# EAGLE design button_pad_6x10_v19 (EAGLE 6.4)
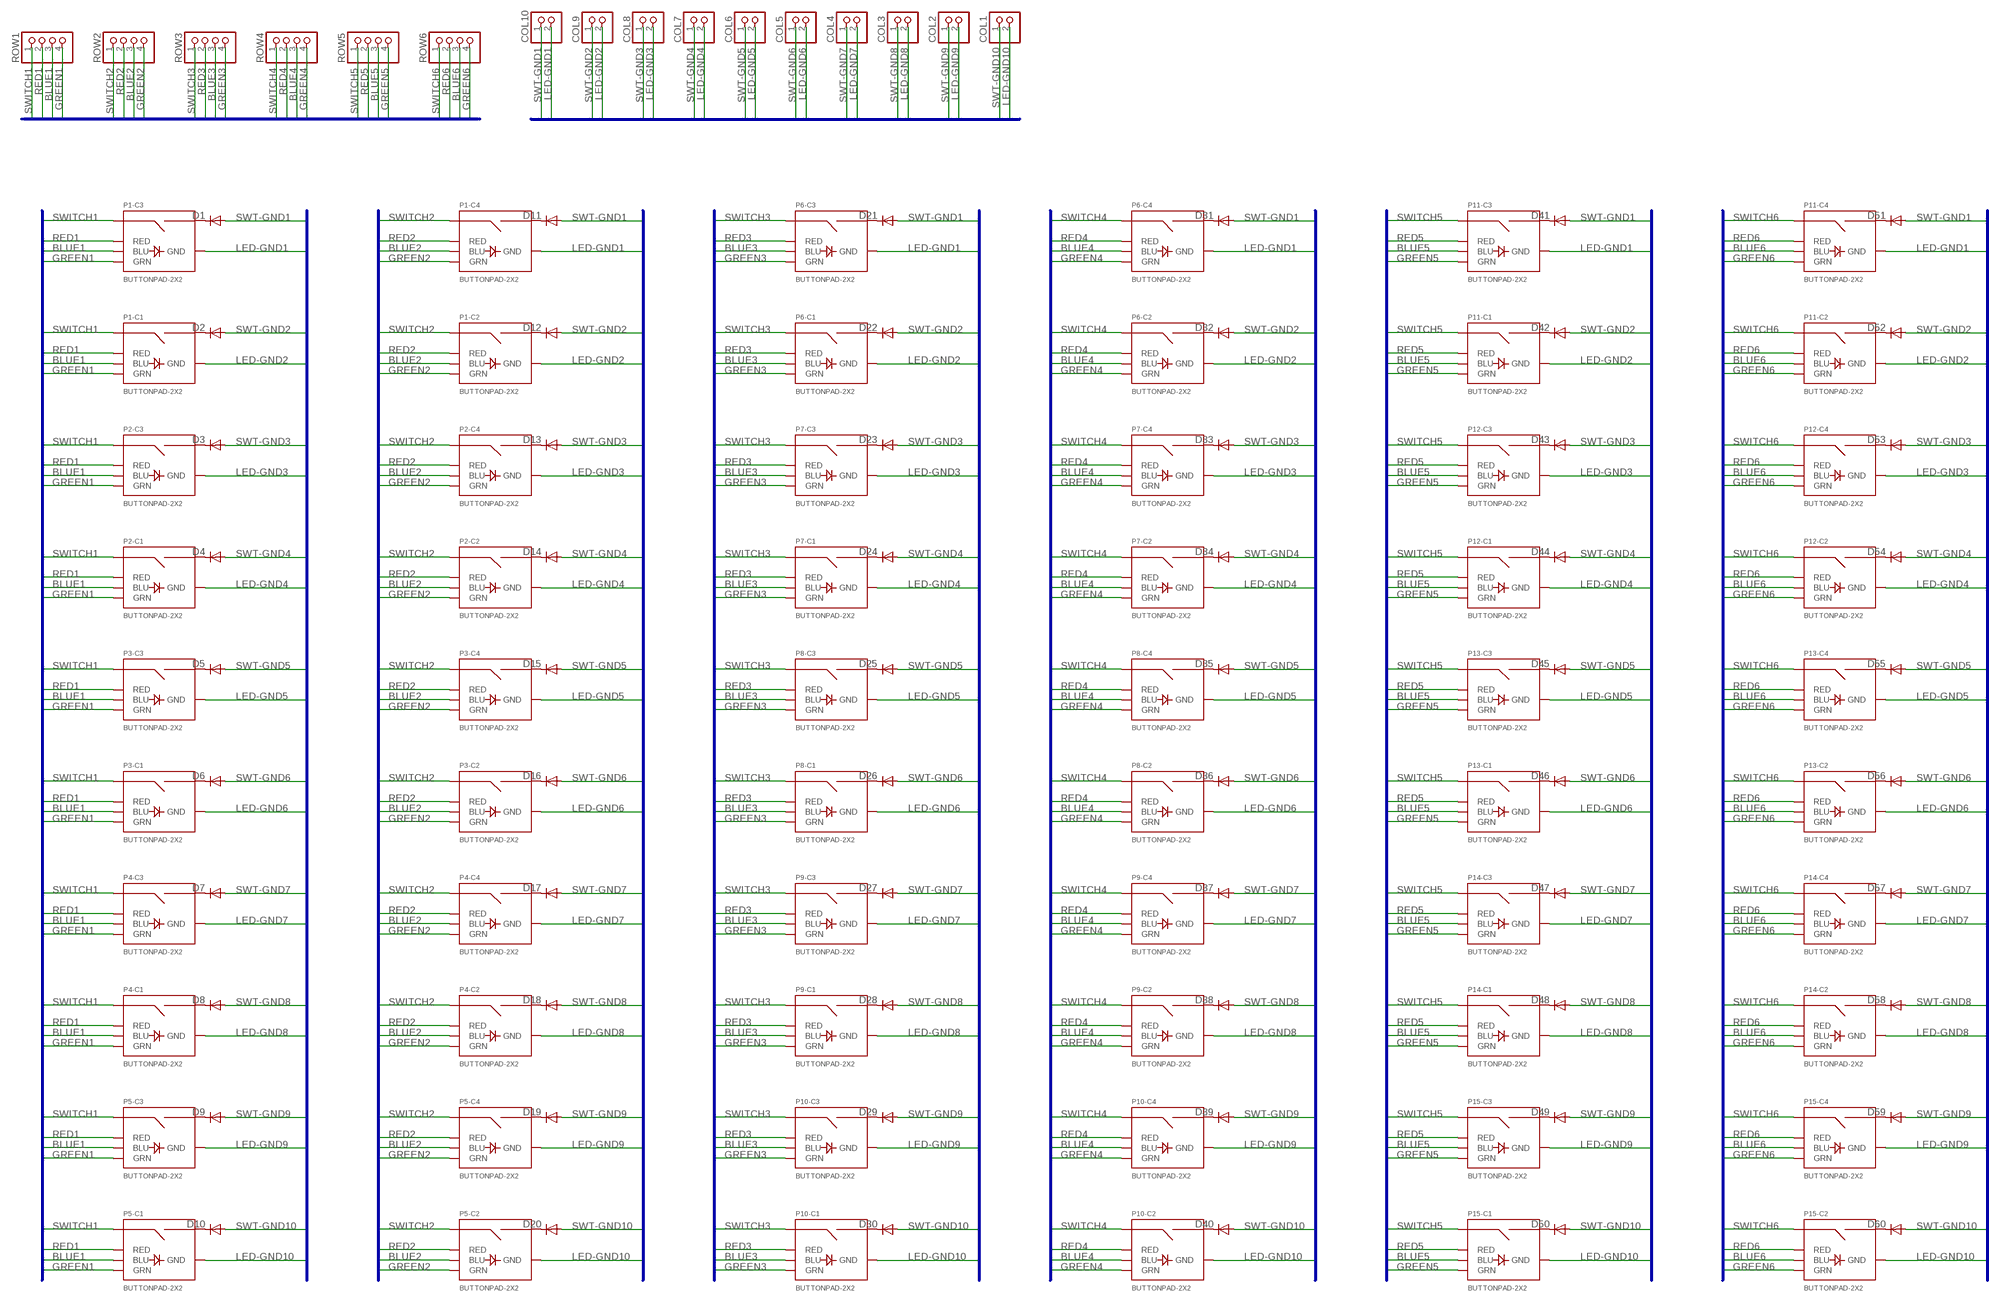
[diagram p0: schematic, sheet 1]

## Parts
COL1  PINHD-1X2  [1X02]
COL2  PINHD-1X2  [1X02]
COL3  PINHD-1X2  [1X02]
COL4  PINHD-1X2  [1X02]
COL5  PINHD-1X2  [1X02]
COL6  PINHD-1X2  [1X02]
COL7  PINHD-1X2  [1X02]
COL8  PINHD-1X2  [1X02]
COL9  PINHD-1X2  [1X02]
COL10  PINHD-1X2  [1X02]
D1  DIODE-1N4148  [DOIDE-1N4148]
D2  DIODE-1N4148  [DOIDE-1N4148]
D3  DIODE-1N4148  [DOIDE-1N4148]
D4  DIODE-1N4148  [DOIDE-1N4148]
D5  DIODE-1N4148  [DOIDE-1N4148]
D6  DIODE-1N4148  [DOIDE-1N4148]
D7  DIODE-1N4148  [DOIDE-1N4148]
D8  DIODE-1N4148  [DOIDE-1N4148]
D9  DIODE-1N4148  [DOIDE-1N4148]
D10  DIODE-1N4148  [DOIDE-1N4148]
D11  DIODE-1N4148  [DOIDE-1N4148]
D12  DIODE-1N4148  [DOIDE-1N4148]
D13  DIODE-1N4148  [DOIDE-1N4148]
D14  DIODE-1N4148  [DOIDE-1N4148]
D15  DIODE-1N4148  [DOIDE-1N4148]
D16  DIODE-1N4148  [DOIDE-1N4148]
D17  DIODE-1N4148  [DOIDE-1N4148]
D18  DIODE-1N4148  [DOIDE-1N4148]
D19  DIODE-1N4148  [DOIDE-1N4148]
D20  DIODE-1N4148  [DOIDE-1N4148]
D21  DIODE-1N4148  [DOIDE-1N4148]
D22  DIODE-1N4148  [DOIDE-1N4148]
D23  DIODE-1N4148  [DOIDE-1N4148]
D24  DIODE-1N4148  [DOIDE-1N4148]
D25  DIODE-1N4148  [DOIDE-1N4148]
D26  DIODE-1N4148  [DOIDE-1N4148]
D27  DIODE-1N4148  [DOIDE-1N4148]
D28  DIODE-1N4148  [DOIDE-1N4148]
D29  DIODE-1N4148  [DOIDE-1N4148]
D30  DIODE-1N4148  [DOIDE-1N4148]
D31  DIODE-1N4148  [DOIDE-1N4148]
D32  DIODE-1N4148  [DOIDE-1N4148]
D33  DIODE-1N4148  [DOIDE-1N4148]
D34  DIODE-1N4148  [DOIDE-1N4148]
D35  DIODE-1N4148  [DOIDE-1N4148]
D36  DIODE-1N4148  [DOIDE-1N4148]
D37  DIODE-1N4148  [DOIDE-1N4148]
D38  DIODE-1N4148  [DOIDE-1N4148]
D39  DIODE-1N4148  [DOIDE-1N4148]
D40  DIODE-1N4148  [DOIDE-1N4148]
D41  DIODE-1N4148  [DOIDE-1N4148]
D42  DIODE-1N4148  [DOIDE-1N4148]
D43  DIODE-1N4148  [DOIDE-1N4148]
D44  DIODE-1N4148  [DOIDE-1N4148]
D45  DIODE-1N4148  [DOIDE-1N4148]
D46  DIODE-1N4148  [DOIDE-1N4148]
D47  DIODE-1N4148  [DOIDE-1N4148]
D48  DIODE-1N4148  [DOIDE-1N4148]
D49  DIODE-1N4148  [DOIDE-1N4148]
D50  DIODE-1N4148  [DOIDE-1N4148]
D51  DIODE-1N4148  [DOIDE-1N4148]
D52  DIODE-1N4148  [DOIDE-1N4148]
D53  DIODE-1N4148  [DOIDE-1N4148]
D54  DIODE-1N4148  [DOIDE-1N4148]
D55  DIODE-1N4148  [DOIDE-1N4148]
D56  DIODE-1N4148  [DOIDE-1N4148]
D57  DIODE-1N4148  [DOIDE-1N4148]
D58  DIODE-1N4148  [DOIDE-1N4148]
D59  DIODE-1N4148  [DOIDE-1N4148]
D60  DIODE-1N4148  [DOIDE-1N4148]
P1  BUTTONPAD-2X2  [BUTTONPAD-2X2]
P2  BUTTONPAD-2X2  [BUTTONPAD-2X2]
P3  BUTTONPAD-2X2  [BUTTONPAD-2X2]
P4  BUTTONPAD-2X2  [BUTTONPAD-2X2]
P5  BUTTONPAD-2X2  [BUTTONPAD-2X2]
P6  BUTTONPAD-2X2  [BUTTONPAD-2X2]
P7  BUTTONPAD-2X2  [BUTTONPAD-2X2]
P8  BUTTONPAD-2X2  [BUTTONPAD-2X2]
P9  BUTTONPAD-2X2  [BUTTONPAD-2X2]
P10  BUTTONPAD-2X2  [BUTTONPAD-2X2]
P11  BUTTONPAD-2X2  [BUTTONPAD-2X2]
P12  BUTTONPAD-2X2  [BUTTONPAD-2X2]
P13  BUTTONPAD-2X2  [BUTTONPAD-2X2]
P14  BUTTONPAD-2X2  [BUTTONPAD-2X2]
P15  BUTTONPAD-2X2  [BUTTONPAD-2X2]
ROW1  PINHD-1X4  [1X04]
ROW2  PINHD-1X4  [1X04]
ROW3  PINHD-1X4  [1X04]
ROW4  PINHD-1X4  [1X04]
ROW5  PINHD-1X4  [1X04]
ROW6  PINHD-1X4  [1X04]

## Nets
BLUE1 [LEDPower]: P1.BLU1(-C1:BLU) P1.BLU3(-C3:BLU) P2.BLU1(-C1:BLU) P2.BLU3(-C3:BLU) P3.BLU1(-C1:BLU) P3.BLU3(-C3:BLU) P4.BLU1(-C1:BLU) P4.BLU3(-C3:BLU) P5.BLU1(-C1:BLU) P5.BLU3(-C3:BLU) ROW1.3
BLUE2 [LEDPower]: P1.BLU2(-C2:BLU) P1.BLU4(-C4:BLU) P2.BLU2(-C2:BLU) P2.BLU4(-C4:BLU) P3.BLU2(-C2:BLU) P3.BLU4(-C4:BLU) P4.BLU2(-C2:BLU) P4.BLU4(-C4:BLU) P5.BLU2(-C2:BLU) P5.BLU4(-C4:BLU) ROW2.3
BLUE3 [LEDPower]: P6.BLU1(-C1:BLU) P6.BLU3(-C3:BLU) P7.BLU1(-C1:BLU) P7.BLU3(-C3:BLU) P8.BLU1(-C1:BLU) P8.BLU3(-C3:BLU) P9.BLU1(-C1:BLU) P9.BLU3(-C3:BLU) P10.BLU1(-C1:BLU) P10.BLU3(-C3:BLU) ROW3.3
BLUE4 [LEDPower]: P6.BLU2(-C2:BLU) P6.BLU4(-C4:BLU) P7.BLU2(-C2:BLU) P7.BLU4(-C4:BLU) P8.BLU2(-C2:BLU) P8.BLU4(-C4:BLU) P9.BLU2(-C2:BLU) P9.BLU4(-C4:BLU) P10.BLU2(-C2:BLU) P10.BLU4(-C4:BLU) ROW4.3
BLUE5 [LEDPower]: P11.BLU1(-C1:BLU) P11.BLU3(-C3:BLU) P12.BLU1(-C1:BLU) P12.BLU3(-C3:BLU) P13.BLU1(-C1:BLU) P13.BLU3(-C3:BLU) P14.BLU1(-C1:BLU) P14.BLU3(-C3:BLU) P15.BLU1(-C1:BLU) P15.BLU3(-C3:BLU) ROW5.3
BLUE6 [LEDPower]: P11.BLU2(-C2:BLU) P11.BLU4(-C4:BLU) P12.BLU2(-C2:BLU) P12.BLU4(-C4:BLU) P13.BLU2(-C2:BLU) P13.BLU4(-C4:BLU) P14.BLU2(-C2:BLU) P14.BLU4(-C4:BLU) P15.BLU2(-C2:BLU) P15.BLU4(-C4:BLU) ROW6.3
GREEN1 [LEDPower]: P1.GRN1(-C1:GRN) P1.GRN3(-C3:GRN) P2.GRN1(-C1:GRN) P2.GRN3(-C3:GRN) P3.GRN1(-C1:GRN) P3.GRN3(-C3:GRN) P4.GRN1(-C1:GRN) P4.GRN3(-C3:GRN) P5.GRN1(-C1:GRN) P5.GRN3(-C3:GRN) ROW1.4
GREEN2 [LEDPower]: P1.GRN2(-C2:GRN) P1.GRN4(-C4:GRN) P2.GRN2(-C2:GRN) P2.GRN4(-C4:GRN) P3.GRN2(-C2:GRN) P3.GRN4(-C4:GRN) P4.GRN2(-C2:GRN) P4.GRN4(-C4:GRN) P5.GRN2(-C2:GRN) P5.GRN4(-C4:GRN) ROW2.4
GREEN3 [LEDPower]: P6.GRN1(-C1:GRN) P6.GRN3(-C3:GRN) P7.GRN1(-C1:GRN) P7.GRN3(-C3:GRN) P8.GRN1(-C1:GRN) P8.GRN3(-C3:GRN) P9.GRN1(-C1:GRN) P9.GRN3(-C3:GRN) P10.GRN1(-C1:GRN) P10.GRN3(-C3:GRN) ROW3.4
GREEN4 [LEDPower]: P6.GRN2(-C2:GRN) P6.GRN4(-C4:GRN) P7.GRN2(-C2:GRN) P7.GRN4(-C4:GRN) P8.GRN2(-C2:GRN) P8.GRN4(-C4:GRN) P9.GRN2(-C2:GRN) P9.GRN4(-C4:GRN) P10.GRN2(-C2:GRN) P10.GRN4(-C4:GRN) ROW4.4
GREEN5 [LEDPower]: P11.GRN1(-C1:GRN) P11.GRN3(-C3:GRN) P12.GRN1(-C1:GRN) P12.GRN3(-C3:GRN) P13.GRN1(-C1:GRN) P13.GRN3(-C3:GRN) P14.GRN1(-C1:GRN) P14.GRN3(-C3:GRN) P15.GRN1(-C1:GRN) P15.GRN3(-C3:GRN) ROW5.4
GREEN6 [LEDPower]: P11.GRN2(-C2:GRN) P11.GRN4(-C4:GRN) P12.GRN2(-C2:GRN) P12.GRN4(-C4:GRN) P13.GRN2(-C2:GRN) P13.GRN4(-C4:GRN) P14.GRN2(-C2:GRN) P14.GRN4(-C4:GRN) P15.GRN2(-C2:GRN) P15.GRN4(-C4:GRN) ROW6.4
LED-GND1 [LEDPower]: COL10.2 P1.GND3(-C3:GND) P1.GND4(-C4:GND) P6.GND3(-C3:GND) P6.GND4(-C4:GND) P11.GND3(-C3:GND) P11.GND4(-C4:GND)
LED-GND2 [LEDPower]: COL9.2 P1.GND1(-C1:GND) P1.GND2(-C2:GND) P6.GND1(-C1:GND) P6.GND2(-C2:GND) P11.GND1(-C1:GND) P11.GND2(-C2:GND)
LED-GND3 [LEDPower]: COL8.2 P2.GND3(-C3:GND) P2.GND4(-C4:GND) P7.GND3(-C3:GND) P7.GND4(-C4:GND) P12.GND3(-C3:GND) P12.GND4(-C4:GND)
LED-GND4 [LEDPower]: COL7.2 P2.GND1(-C1:GND) P2.GND2(-C2:GND) P7.GND1(-C1:GND) P7.GND2(-C2:GND) P12.GND1(-C1:GND) P12.GND2(-C2:GND)
LED-GND5 [LEDPower]: COL6.2 P3.GND3(-C3:GND) P3.GND4(-C4:GND) P8.GND3(-C3:GND) P8.GND4(-C4:GND) P13.GND3(-C3:GND) P13.GND4(-C4:GND)
LED-GND6 [LEDPower]: COL5.2 P3.GND1(-C1:GND) P3.GND2(-C2:GND) P8.GND1(-C1:GND) P8.GND2(-C2:GND) P13.GND1(-C1:GND) P13.GND2(-C2:GND)
LED-GND7 [LEDPower]: COL4.2 P4.GND3(-C3:GND) P4.GND4(-C4:GND) P9.GND3(-C3:GND) P9.GND4(-C4:GND) P14.GND3(-C3:GND) P14.GND4(-C4:GND)
LED-GND8 [LEDPower]: COL3.2 P4.GND1(-C1:GND) P4.GND2(-C2:GND) P9.GND1(-C1:GND) P9.GND2(-C2:GND) P14.GND1(-C1:GND) P14.GND2(-C2:GND)
LED-GND9 [LEDPower]: COL2.2 P5.GND3(-C3:GND) P5.GND4(-C4:GND) P10.GND3(-C3:GND) P10.GND4(-C4:GND) P15.GND3(-C3:GND) P15.GND4(-C4:GND)
LED-GND10 [LEDPower]: COL1.2 P5.GND1(-C1:GND) P5.GND2(-C2:GND) P10.GND1(-C1:GND) P10.GND2(-C2:GND) P15.GND1(-C1:GND) P15.GND2(-C2:GND)
N$1: D1.P$2(C) P1.SIG6(-C3:SIG2)
N$2: D2.P$2(C) P1.SIG2(-C1:SIG2)
N$3: D3.P$2(C) P2.SIG6(-C3:SIG2)
N$4: D4.P$2(C) P2.SIG2(-C1:SIG2)
N$5: D5.P$2(C) P3.SIG6(-C3:SIG2)
N$6: D6.P$2(C) P3.SIG2(-C1:SIG2)
N$7: D16.P$2(C) P3.SIG4(-C2:SIG2)
N$8: D15.P$2(C) P3.SIG8(-C4:SIG2)
N$9: D14.P$2(C) P2.SIG4(-C2:SIG2)
N$10: D13.P$2(C) P2.SIG8(-C4:SIG2)
N$11: D12.P$2(C) P1.SIG4(-C2:SIG2)
N$12: D11.P$2(C) P1.SIG8(-C4:SIG2)
N$13: D7.P$2(C) P4.SIG6(-C3:SIG2)
N$14: D8.P$2(C) P4.SIG2(-C1:SIG2)
N$15: D9.P$2(C) P5.SIG6(-C3:SIG2)
N$16: D10.P$2(C) P5.SIG2(-C1:SIG2)
N$17: D21.P$2(C) P6.SIG6(-C3:SIG2)
N$18: D22.P$2(C) P6.SIG2(-C1:SIG2)
N$19: D32.P$2(C) P6.SIG4(-C2:SIG2)
N$20: D31.P$2(C) P6.SIG8(-C4:SIG2)
N$21: D20.P$2(C) P5.SIG4(-C2:SIG2)
N$22: D19.P$2(C) P5.SIG8(-C4:SIG2)
N$23: D18.P$2(C) P4.SIG4(-C2:SIG2)
N$24: D17.P$2(C) P4.SIG8(-C4:SIG2)
N$25: D23.P$2(C) P7.SIG6(-C3:SIG2)
N$26: D24.P$2(C) P7.SIG2(-C1:SIG2)
N$27: D33.P$2(C) P7.SIG8(-C4:SIG2)
N$28: D34.P$2(C) P7.SIG4(-C2:SIG2)
N$29: D30.P$2(C) P10.SIG2(-C1:SIG2)
N$30: D29.P$2(C) P10.SIG6(-C3:SIG2)
N$31: D39.P$2(C) P10.SIG8(-C4:SIG2)
N$32: D40.P$2(C) P10.SIG4(-C2:SIG2)
N$33: D46.P$2(C) P13.SIG2(-C1:SIG2)
N$34: D45.P$2(C) P13.SIG6(-C3:SIG2)
N$35: D55.P$2(C) P13.SIG8(-C4:SIG2)
N$36: D56.P$2(C) P13.SIG4(-C2:SIG2)
N$37: D47.P$2(C) P14.SIG6(-C3:SIG2)
N$38: D48.P$2(C) P14.SIG2(-C1:SIG2)
N$39: D58.P$2(C) P14.SIG4(-C2:SIG2)
N$40: D57.P$2(C) P14.SIG8(-C4:SIG2)
N$41: D51.P$2(C) P11.SIG8(-C4:SIG2)
N$42: D41.P$2(C) P11.SIG6(-C3:SIG2)
N$43: D42.P$2(C) P11.SIG2(-C1:SIG2)
N$44: D52.P$2(C) P11.SIG4(-C2:SIG2)
N$45: D25.P$2(C) P8.SIG6(-C3:SIG2)
N$46: D35.P$2(C) P8.SIG8(-C4:SIG2)
N$47: D36.P$2(C) P8.SIG4(-C2:SIG2)
N$48: D26.P$2(C) P8.SIG2(-C1:SIG2)
N$49: D27.P$2(C) P9.SIG6(-C3:SIG2)
N$50: D28.P$2(C) P9.SIG2(-C1:SIG2)
N$51: D37.P$2(C) P9.SIG8(-C4:SIG2)
N$52: D38.P$2(C) P9.SIG4(-C2:SIG2)
N$53: D43.P$2(C) P12.SIG6(-C3:SIG2)
N$54: D44.P$2(C) P12.SIG2(-C1:SIG2)
N$55: D53.P$2(C) P12.SIG8(-C4:SIG2)
N$56: D54.P$2(C) P12.SIG4(-C2:SIG2)
N$57: D50.P$2(C) P15.SIG2(-C1:SIG2)
N$58: D49.P$2(C) P15.SIG6(-C3:SIG2)
N$59: D59.P$2(C) P15.SIG8(-C4:SIG2)
N$60: D60.P$2(C) P15.SIG4(-C2:SIG2)
RED1 [LEDPower]: P1.RED1(-C1:RED) P1.RED3(-C3:RED) P2.RED1(-C1:RED) P2.RED3(-C3:RED) P3.RED1(-C1:RED) P3.RED3(-C3:RED) P4.RED1(-C1:RED) P4.RED3(-C3:RED) P5.RED1(-C1:RED) P5.RED3(-C3:RED) ROW1.2
RED2 [LEDPower]: P1.RED2(-C2:RED) P1.RED4(-C4:RED) P2.RED2(-C2:RED) P2.RED4(-C4:RED) P3.RED2(-C2:RED) P3.RED4(-C4:RED) P4.RED2(-C2:RED) P4.RED4(-C4:RED) P5.RED2(-C2:RED) P5.RED4(-C4:RED) ROW2.2
RED3 [LEDPower]: P6.RED1(-C1:RED) P6.RED3(-C3:RED) P7.RED1(-C1:RED) P7.RED3(-C3:RED) P8.RED1(-C1:RED) P8.RED3(-C3:RED) P9.RED1(-C1:RED) P9.RED3(-C3:RED) P10.RED1(-C1:RED) P10.RED3(-C3:RED) ROW3.2
RED4 [LEDPower]: P6.RED2(-C2:RED) P6.RED4(-C4:RED) P7.RED2(-C2:RED) P7.RED4(-C4:RED) P8.RED2(-C2:RED) P8.RED4(-C4:RED) P9.RED2(-C2:RED) P9.RED4(-C4:RED) P10.RED2(-C2:RED) P10.RED4(-C4:RED) ROW4.2
RED5 [LEDPower]: P11.RED1(-C1:RED) P11.RED3(-C3:RED) P12.RED1(-C1:RED) P12.RED3(-C3:RED) P13.RED1(-C1:RED) P13.RED3(-C3:RED) P14.RED1(-C1:RED) P14.RED3(-C3:RED) P15.RED1(-C1:RED) P15.RED3(-C3:RED) ROW5.2
RED6 [LEDPower]: P11.RED2(-C2:RED) P11.RED4(-C4:RED) P12.RED2(-C2:RED) P12.RED4(-C4:RED) P13.RED2(-C2:RED) P13.RED4(-C4:RED) P14.RED2(-C2:RED) P14.RED4(-C4:RED) P15.RED2(-C2:RED) P15.RED4(-C4:RED) ROW6.2
SWITCH1 [ButtonSignal]: P1.SIG1(-C1:SIG1) P1.SIG5(-C3:SIG1) P2.SIG1(-C1:SIG1) P2.SIG5(-C3:SIG1) P3.SIG1(-C1:SIG1) P3.SIG5(-C3:SIG1) P4.SIG1(-C1:SIG1) P4.SIG5(-C3:SIG1) P5.SIG1(-C1:SIG1) P5.SIG5(-C3:SIG1) ROW1.1
SWITCH2 [ButtonSignal]: P1.SIG3(-C2:SIG1) P1.SIG7(-C4:SIG1) P2.SIG3(-C2:SIG1) P2.SIG7(-C4:SIG1) P3.SIG3(-C2:SIG1) P3.SIG7(-C4:SIG1) P4.SIG3(-C2:SIG1) P4.SIG7(-C4:SIG1) P5.SIG3(-C2:SIG1) P5.SIG7(-C4:SIG1) ROW2.1
SWITCH3 [ButtonSignal]: P6.SIG1(-C1:SIG1) P6.SIG5(-C3:SIG1) P7.SIG1(-C1:SIG1) P7.SIG5(-C3:SIG1) P8.SIG1(-C1:SIG1) P8.SIG5(-C3:SIG1) P9.SIG1(-C1:SIG1) P9.SIG5(-C3:SIG1) P10.SIG1(-C1:SIG1) P10.SIG5(-C3:SIG1) ROW3.1
SWITCH4 [ButtonSignal]: P6.SIG3(-C2:SIG1) P6.SIG7(-C4:SIG1) P7.SIG3(-C2:SIG1) P7.SIG7(-C4:SIG1) P8.SIG3(-C2:SIG1) P8.SIG7(-C4:SIG1) P9.SIG3(-C2:SIG1) P9.SIG7(-C4:SIG1) P10.SIG3(-C2:SIG1) P10.SIG7(-C4:SIG1) ROW4.1
SWITCH5 [ButtonSignal]: P11.SIG1(-C1:SIG1) P11.SIG5(-C3:SIG1) P12.SIG1(-C1:SIG1) P12.SIG5(-C3:SIG1) P13.SIG1(-C1:SIG1) P13.SIG5(-C3:SIG1) P14.SIG1(-C1:SIG1) P14.SIG5(-C3:SIG1) P15.SIG1(-C1:SIG1) P15.SIG5(-C3:SIG1) ROW5.1
SWITCH6 [ButtonSignal]: P11.SIG3(-C2:SIG1) P11.SIG7(-C4:SIG1) P12.SIG3(-C2:SIG1) P12.SIG7(-C4:SIG1) P13.SIG3(-C2:SIG1) P13.SIG7(-C4:SIG1) P14.SIG3(-C2:SIG1) P14.SIG7(-C4:SIG1) P15.SIG3(-C2:SIG1) P15.SIG7(-C4:SIG1) ROW6.1
SWT-GND1 [ButtonSignal]: COL10.1 D1.P$1(A) D11.P$1(A) D21.P$1(A) D31.P$1(A) D41.P$1(A) D51.P$1(A)
SWT-GND2 [ButtonSignal]: COL9.1 D2.P$1(A) D12.P$1(A) D22.P$1(A) D32.P$1(A) D42.P$1(A) D52.P$1(A)
SWT-GND3 [ButtonSignal]: COL8.1 D3.P$1(A) D13.P$1(A) D23.P$1(A) D33.P$1(A) D43.P$1(A) D53.P$1(A)
SWT-GND4 [ButtonSignal]: COL7.1 D4.P$1(A) D14.P$1(A) D24.P$1(A) D34.P$1(A) D44.P$1(A) D54.P$1(A)
SWT-GND5 [ButtonSignal]: COL6.1 D5.P$1(A) D15.P$1(A) D25.P$1(A) D35.P$1(A) D45.P$1(A) D55.P$1(A)
SWT-GND6 [ButtonSignal]: COL5.1 D6.P$1(A) D16.P$1(A) D26.P$1(A) D36.P$1(A) D46.P$1(A) D56.P$1(A)
SWT-GND7 [ButtonSignal]: COL4.1 D7.P$1(A) D17.P$1(A) D27.P$1(A) D37.P$1(A) D47.P$1(A) D57.P$1(A)
SWT-GND8 [ButtonSignal]: COL3.1 D8.P$1(A) D18.P$1(A) D28.P$1(A) D38.P$1(A) D48.P$1(A) D58.P$1(A)
SWT-GND9 [ButtonSignal]: COL2.1 D9.P$1(A) D19.P$1(A) D29.P$1(A) D39.P$1(A) D49.P$1(A) D59.P$1(A)
SWT-GND10 [ButtonSignal]: COL1.1 D10.P$1(A) D20.P$1(A) D30.P$1(A) D40.P$1(A) D50.P$1(A) D60.P$1(A)

## Buses
SWITCH[1..6],RED[1..6],BLUE[1..6],GREEN[1..6]
SWITCH2,RED2,BLUE2,GREEN2
SWT-GND[1..10],LED-GND[1..10]
SWITCH1,RED1,BLUE1,GREEN1
SWITCH3,RED3,BLUE3,GREEN3
SWITCH4,RED4,BLUE4,GREEN4
SWITCH5,RED5,BLUE5,GREEN5
SWITCH6,RED6,BLUE6,GREEN6

## Library data of the parts
COL1-COL10 = pinhead:PINHD-1X2: PIN HEADER
D1-D60 = SparkFun:DIODE-1N4148
P1-P15 = SparkFun-Electromechanical:BUTTONPAD-2X2: Proven layout and schematic for 2x2 button pad. Panelize this device/fp to a 4x4 pad if needed. Spark Fun Electronics SKU : COM-07835. Compatible common cathode tri-color LED SKU : COM-00105
ROW1-ROW6 = pinhead:PINHD-1X4: PIN HEADER

## Net classes
0 Default: width 0.203 mm, clearance 0.203 mm
1 Power: width 0.203 mm, clearance 0.203 mm
2 LEDPower: width 0.203 mm, clearance 0.203 mm
3 ButtonSignal: width 0.203 mm, clearance 0.203 mm

## Board
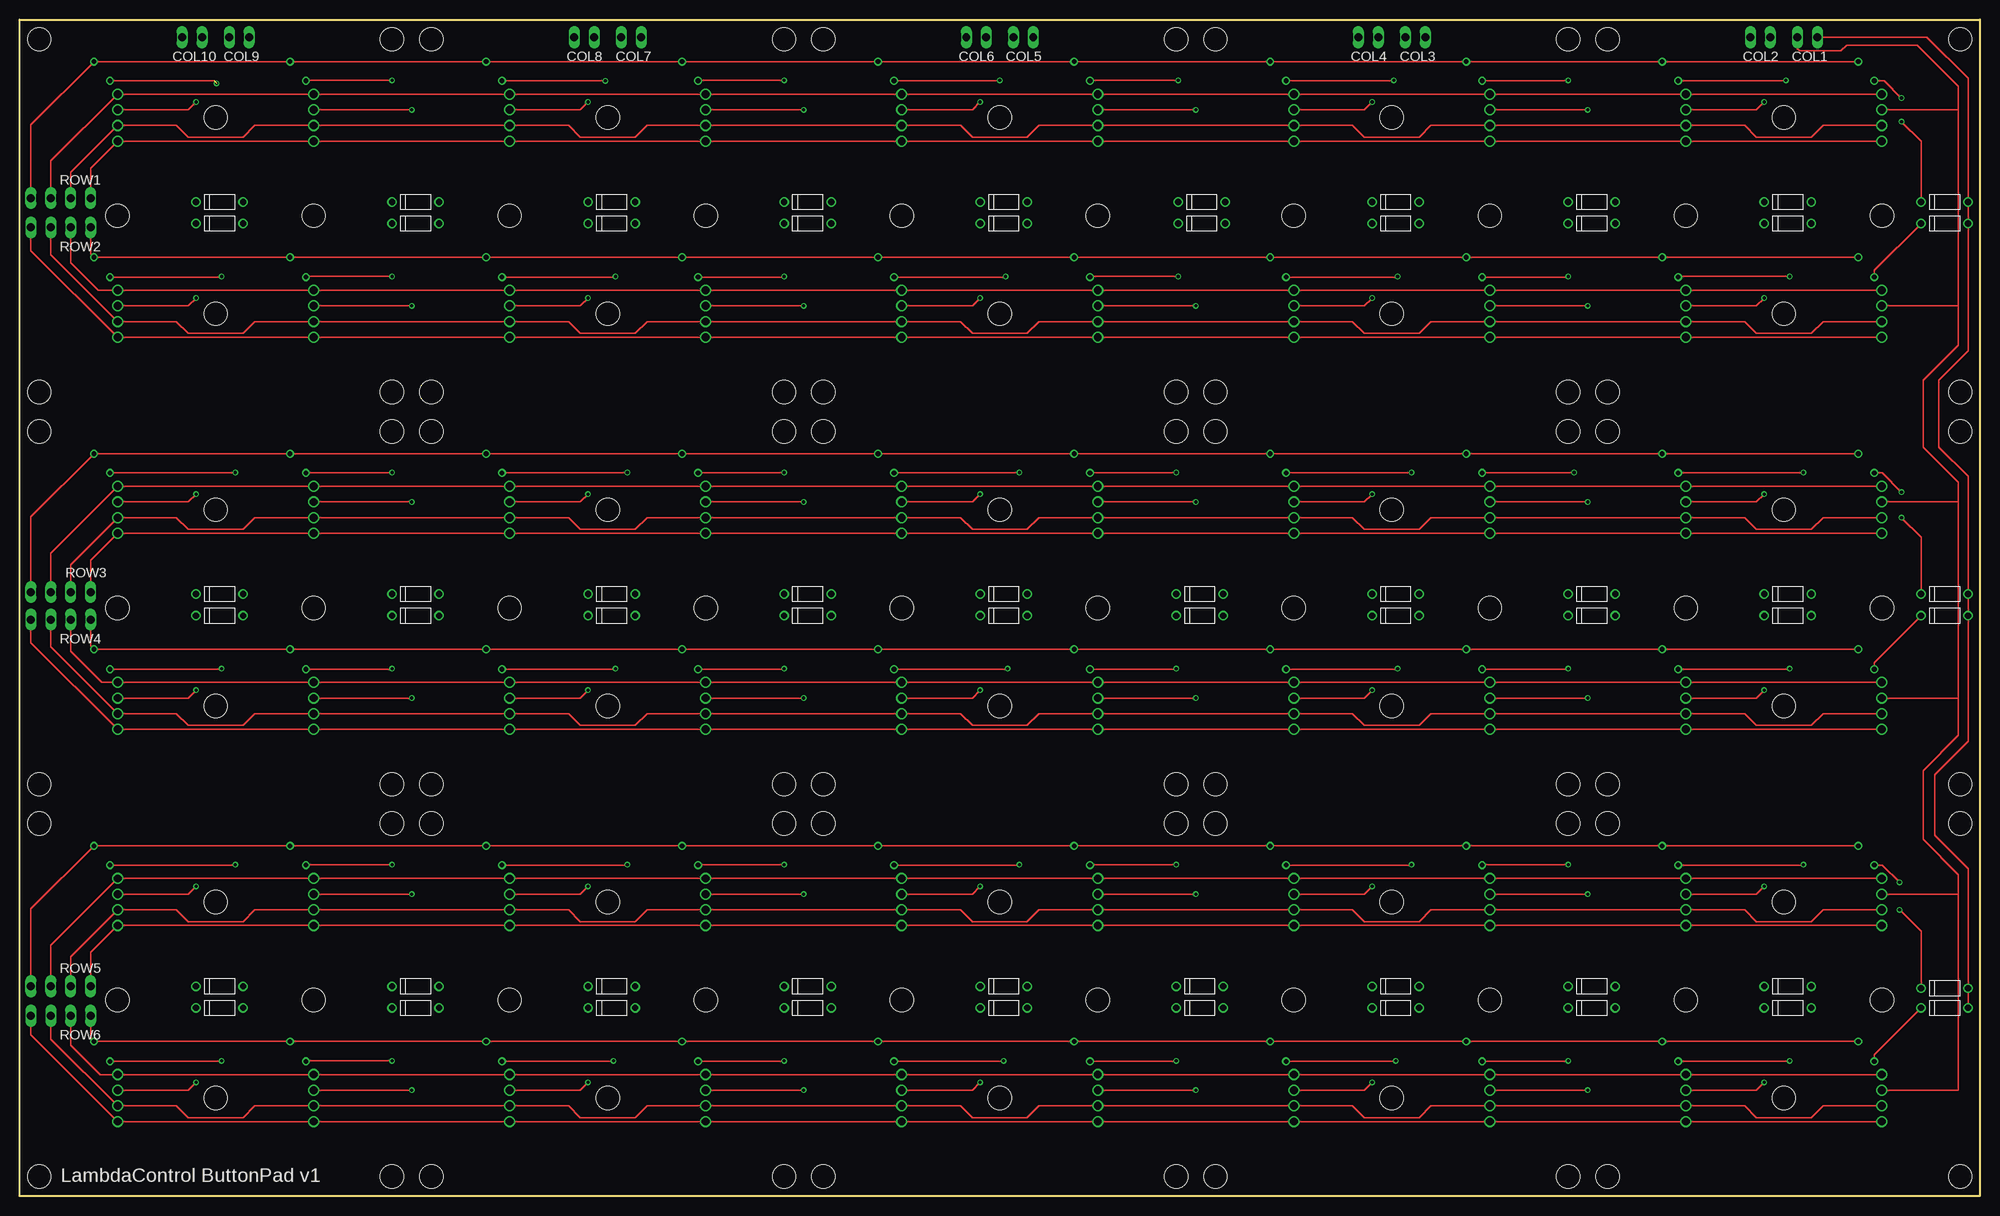
[diagram p1: board, top side]
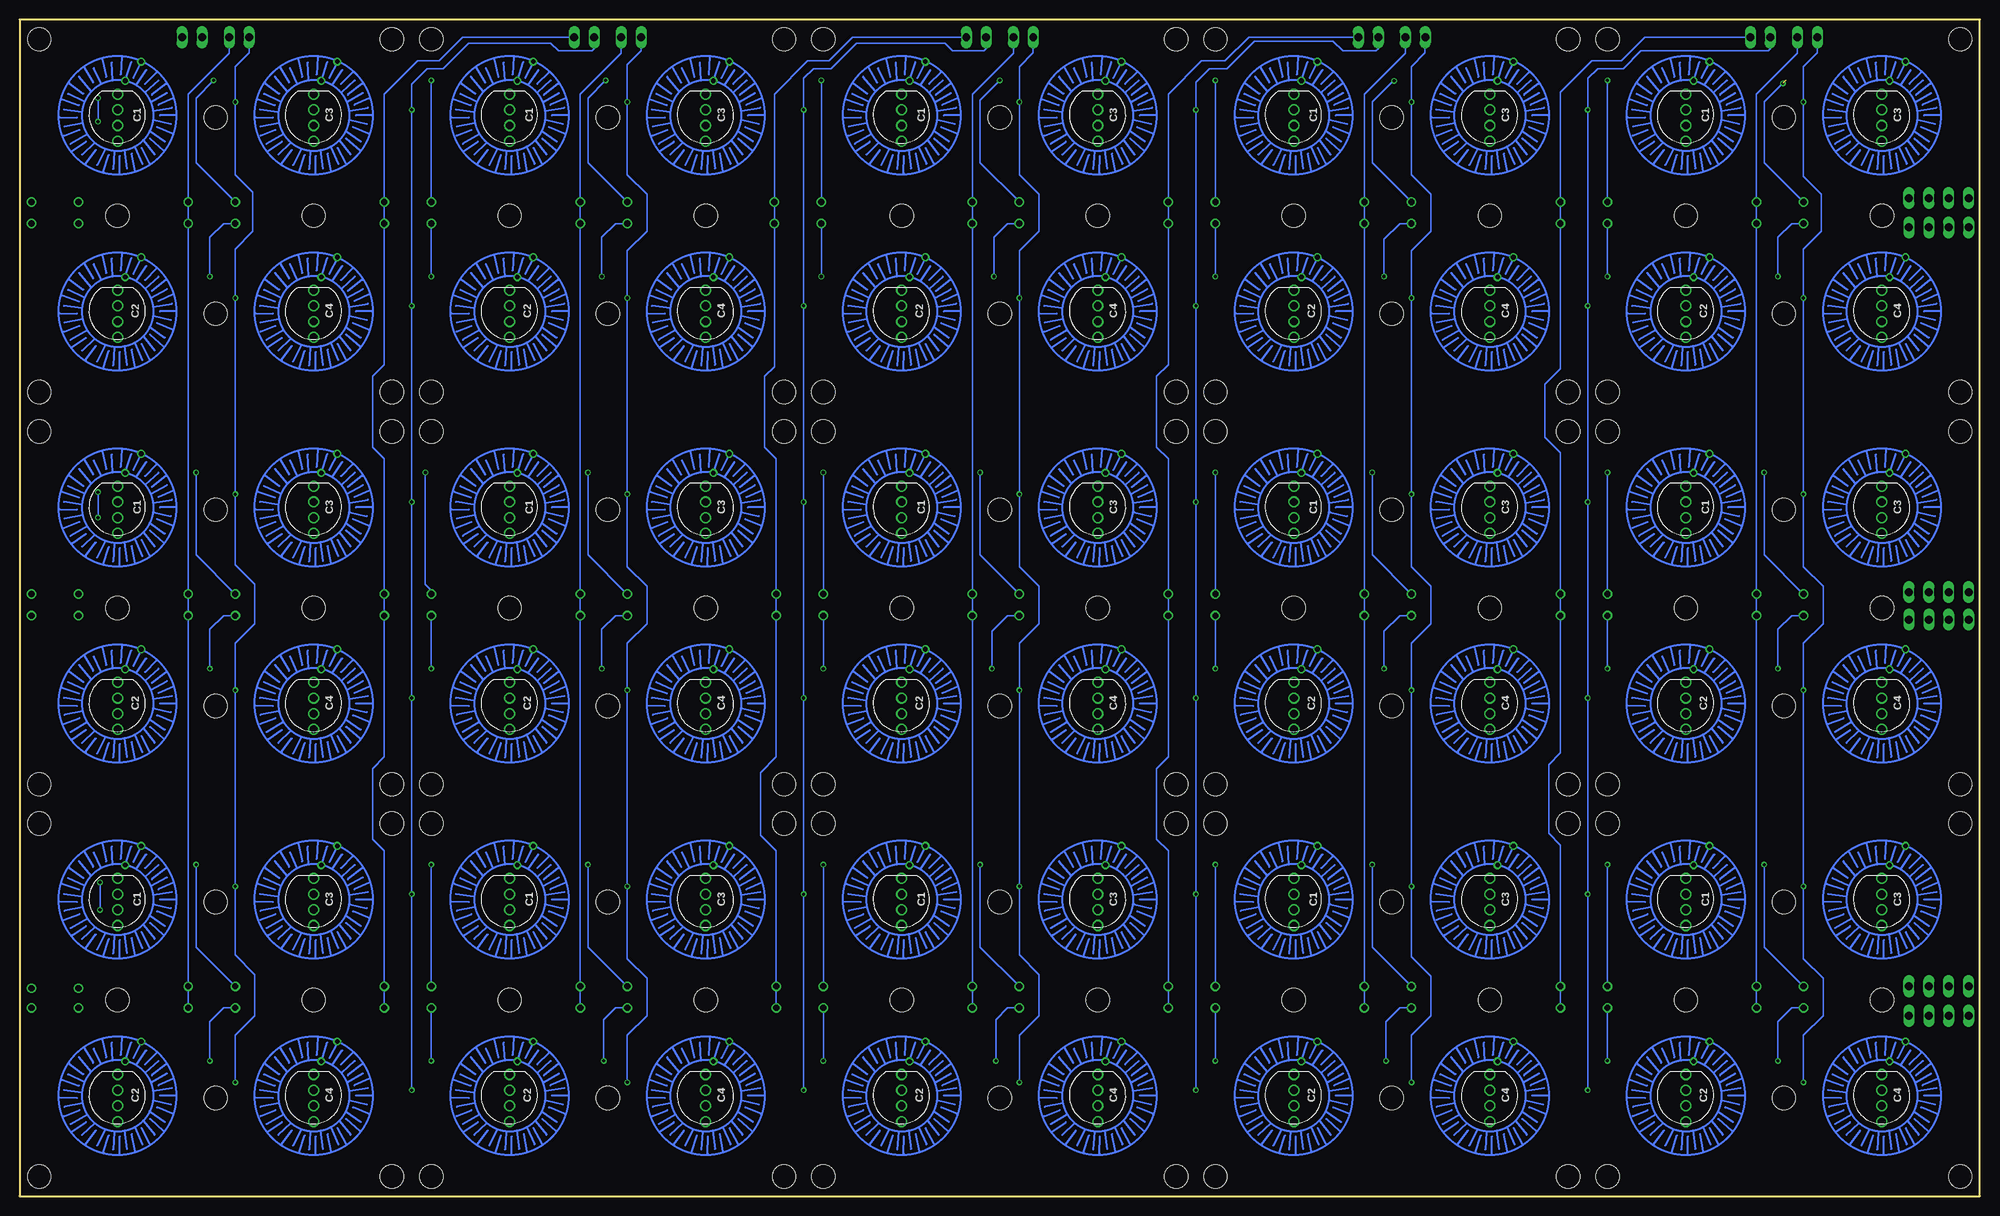
[diagram p2: board, bottom side, seen from below]

Size 250 x 150 mm. Coordinates in mm from the lower left corner, seen from the top.
Outline: 0,0 0,150 250,150 250,0 0,0
Copper layers (1*16): Top 0.035mm / dielectric 1.5mm / Bottom 0.035mm
Design rules "Aetzwerk-DRC 2 Lagen 35µm Cu *": minimum track width 6mil, minimum drill 12mil, track to track 6mil, track to pad 6mil, pad to pad 6mil, via to via 6mil, smd to smd 6mil, copper to edge 20mil, drill to drill 8mil, minimum pad ring 8mil, minimum via ring 6mil, stop-mask expansion 3mil, vias tented up to drill 20mil, thermal gap 8mil

### Footprints (pad centres in the part's own frame; a part is rotated, then mirrored left to right if it is on the bottom)
1X02 = drill 1.016 long: 1 -1.27,0; 2 1.27,0
DOIDE-1N4148 = drill 0.8: P$1 3,0; P$2 -3,0
BUTTONPAD-2X2 = drill 1: BLU1 13.5,12.5; BLU2 38.5,12.5; BLU3 13.5,37.5; BLU4 38.5,37.5; GND1 11.5,12.5; GND2 36.5,12.5; GND3 11.5,37.5; GND4 36.5,37.5; GRN1 15.5,12.5; GRN2 40.5,12.5; GRN3 15.5,37.5; GRN4 40.5,37.5; RED1 9.5,12.5; RED2 34.5,12.5; RED3 9.5,37.5; RED4 34.5,37.5 | drill 0.6: SIG1 5.35,15.513; SIG2 7.8,13.481; SIG3 30.288,15.513; SIG4 32.828,13.481; SIG5 5.35,40.513; SIG6 7.8,38.481; SIG7 30.288,40.513; SIG8 32.828,38.481 | hole 3: 12.5,25; 25,37.5; 37.5,25; 25,12.5; 2.5,2.5; 2.5,47.5; 47.5,47.5; 47.5,2.5
1X04 = drill 1.016 long: 1 -3.81,0; 2 -1.27,0; 3 1.27,0; 4 3.81,0

### Placement (x,y rotation side)
COL1  228,147.75 180 top
COL2  222,147.75 180 top
COL3  178,147.75 180 top
COL4  172,147.75 180 top
COL5  128,147.75 180 top
COL6  122,147.75 180 top
COL7  78,147.75 180 top
COL8  72,147.75 180 top
COL9  28,147.75 180 top
COL10  22,147.75 180 top
D1  25.5,126.75 0 top
D2  50.5,126.75 0 top
D3  75.5,126.75 0 top
D4  100.5,126.75 0 top
D5  125.5,126.75 0 top
D6  150.75,126.75 0 top
D7  175.5,126.75 0 top
D8  200.5,126.75 0 top
D9  225.5,126.75 0 top
D10  245.5,126.75 0 top
D11  25.5,124 0 top
D12  50.5,124 0 top
D13  75.5,124 0 top
D14  100.5,124 0 top
D15  125.5,124 0 top
D16  150.75,124 0 top
D17  175.5,124 0 top
D18  200.5,124 0 top
D19  225.5,124 0 top
D20  245.5,124 0 top
D21  25.5,76.75 0 top
D22  50.5,76.75 0 top
D23  75.5,76.75 0 top
D24  100.5,76.75 0 top
D25  125.5,76.75 0 top
D26  150.5,76.75 0 top
D27  175.5,76.75 0 top
D28  200.5,76.75 0 top
D29  225.5,76.75 0 top
D30  245.5,76.75 0 top
D31  25.5,74 0 top
D32  50.5,74 0 top
D33  75.5,74 0 top
D34  100.5,74 0 top
D35  125.5,74 0 top
D36  150.5,74 0 top
D37  175.5,74 0 top
D38  200.5,74 0 top
D39  225.5,74 0 top
D40  245.5,74 0 top
D41  25.5,26.75 0 top
D42  50.5,26.75 0 top
D43  75.5,26.75 0 top
D44  100.5,26.75 0 top
D45  125.5,26.75 0 top
D46  150.5,26.75 0 top
D47  175.5,26.75 0 top
D48  200.5,26.75 0 top
D49  225.5,26.75 0 top
D50  245.5,26.5 0 top
D51  25.5,24 0 top
D52  50.5,24 0 top
D53  75.5,24 0 top
D54  100.5,24 0 top
D55  125.5,24 0 top
D56  150.5,24 0 top
D57  175.5,24 0 top
D58  200.5,24 0 top
D59  225.5,24 0 top
D60  245.5,24 0 top
P1  50,150 270 bottom
P2  100,150 270 bottom
P3  150,150 270 bottom
P4  200,150 270 bottom
P5  250,150 270 bottom
P6  50,100 270 bottom
P7  100,100 270 bottom
P8  150,100 270 bottom
P9  200,100 270 bottom
P10  250,100 270 bottom
P11  50,50 270 bottom
P12  100,50 270 bottom
P13  150,50 270 bottom
P14  200,50 270 bottom
P15  250,50 270 bottom
ROW1  5.25,127.25 0 top
ROW2  5.25,123.5 180 top
ROW3  5.25,77 0 top
ROW4  5.25,73.5 180 top
ROW5  5.25,26.75 0 top
ROW6  5.25,23 180 top

### Tracks (layer width: path | path; a pad name or v marks a point on that pad's centre or on a via)
BLUE1
  Top 0.204: ROW1.3 6.52,130.52 P1.BLU3 20,136.5 21.5,135 28.5,135 30,136.5 P1.BLU1 P2.BLU3 70,136.5 71.5,135 78.5,135 80,136.5 P2.BLU1 P3.BLU3 120,136.5 121.5,135 128.5,135 130,136.5 P3.BLU1 P4.BLU3 170,136.5 171.5,135 178.5,135 180,136.5 P4.BLU1 P5.BLU3 220,136.5 221.5,135 228.5,135 230,136.5 P5.BLU1
BLUE2
  Top 0.204: ROW2.3 3.98,120.02 P1.BLU4 20,111.5 21.5,110 28.5,110 30,111.5 P1.BLU2 P2.BLU4 70,111.5 71.5,110 78.5,110 80,111.5 P2.BLU2 P3.BLU4 120,111.5 121.5,110 128.5,110 130,111.5 P3.BLU2 P4.BLU4 170,111.5 171.5,110 178.5,110 180,111.5 P4.BLU2 P5.BLU4 220,111.5 221.5,110 228.5,110 230,111.5 P5.BLU2
BLUE3
  Top 0.204: ROW3.3 6.52,80.52 P6.BLU3 20,86.5 21.5,85 28.5,85 30,86.5 P6.BLU1 P7.BLU3 70,86.5 71.5,85 78.5,85 80,86.5 P7.BLU1 P8.BLU3 120,86.5 121.5,85 128.5,85 130,86.5 P8.BLU1 P9.BLU3 170,86.5 171.5,85 178.5,85 180,86.5 P9.BLU1 P10.BLU3 220,86.5 221.5,85 228.5,85 230,86.5 P10.BLU1
BLUE4
  Top 0.204: ROW4.3 3.98,70.02 P6.BLU4 20,61.5 21.5,60 28.5,60 30,61.5 P6.BLU2 P7.BLU4 70,61.5 71.5,60 78.5,60 80,61.5 P7.BLU2 P8.BLU4 120,61.5 121.5,60 128.5,60 130,61.5 P8.BLU2 P9.BLU4 170,61.5 171.5,60 178.5,60 180,61.5 P9.BLU2 P10.BLU4 220,61.5 221.5,60 228.5,60 230,61.5 P10.BLU2
BLUE5
  Top 0.204: ROW5.3 6.52,30.52 P11.BLU3 20,36.5 21.5,35 28.5,35 30,36.5 P11.BLU1 P12.BLU3 70,36.5 71.5,35 78.5,35 80,36.5 P12.BLU1 P13.BLU3 120,36.5 121.5,35 128.5,35 130,36.5 P13.BLU1 P14.BLU3 170,36.5 171.5,35 178.5,35 180,36.5 P14.BLU1 P15.BLU3 220,36.5 221.5,35 228.5,35 230,36.5 P15.BLU1
BLUE6
  Top 0.204: ROW6.3 3.98,20.02 P11.BLU4 20,11.5 21.5,10 28.5,10 30,11.5 P11.BLU2 P12.BLU4 70,11.5 71.5,10 78.5,10 80,11.5 P12.BLU2 P13.BLU4 120,11.5 121.5,10 128.5,10 130,11.5 P13.BLU2 P14.BLU4 170,11.5 171.5,10 178.5,10 180,11.5 P14.BLU2 P15.BLU4 220,11.5 221.5,10 228.5,10 230,11.5 P15.BLU2
GREEN1
  Top 0.204: P5.GRN1 P5.GRN3 P4.GRN1 P4.GRN3 P3.GRN1 P3.GRN3 P2.GRN1 P2.GRN3 P1.GRN1 P1.GRN3 9.06,131.06 ROW1.4
GREEN2
  Top 0.204: P5.GRN2 P5.GRN4 P4.GRN2 P4.GRN4 P3.GRN2 P3.GRN4 P2.GRN2 P2.GRN4 P1.GRN2 P1.GRN4 1.44,120.56 ROW2.4
GREEN3
  Top 0.204: P10.GRN1 P10.GRN3 P9.GRN1 P9.GRN3 P8.GRN1 P8.GRN3 P7.GRN1 P7.GRN3 P6.GRN1 P6.GRN3 9.06,81.06 ROW3.4
GREEN4
  Top 0.204: P10.GRN2 P10.GRN4 P9.GRN2 P9.GRN4 P8.GRN2 P8.GRN4 P7.GRN2 P7.GRN4 P6.GRN2 P6.GRN4 1.44,70.56 ROW4.4
GREEN5
  Top 0.204: P15.GRN1 P15.GRN3 P14.GRN1 P14.GRN3 P13.GRN1 P13.GRN3 P12.GRN1 P12.GRN3 P11.GRN1 P11.GRN3 9.06,31.06 ROW5.4
GREEN6
  Top 0.204: P15.GRN2 P15.GRN4 P14.GRN2 P14.GRN4 P13.GRN2 P13.GRN4 P12.GRN2 P12.GRN4 P11.GRN2 P11.GRN4 1.44,20.56 ROW6.4
LED-GND1  (via drill 0.4, 0.4 pad 0.5)
  Top 0.204: P6.GND3 21.5,88.5 v22.5,89.5 | P6.GND4 21.5,63.5 v22.5,64.5 | P1.GND4 21.5,113.5 v22.5,114.5 | P1.GND3 21.5,138.5 v22.5,139.5 | P11.GND3 21.5,38.5 v22.5,39.5 | P11.GND4 21.5,13.5 v22.5,14.5
  Bottom 0.204: v22.5,14.5 22.5,20.5 20,23 20,27.75 22.5,30.25 v22.5,39.5 v22.5,64.5 22.5,70.5 20,73 20,77.75 22.5,80.25 v22.5,89.5 v22.5,114.5 22.5,120.75 20.25,123 20.25,127.75 22.5,130 v22.5,139.5 22.5,144 20.75,145.75 20.75,147.73 COL10.2
LED-GND2  (via drill 0.4)
  Top 0.204: v50,13.5 P11.GND2 | P11.GND1 v50,38.5 | P6.GND2 v50,63.5 | P6.GND1 v50,88.5 | P1.GND2 v50,113.5 | P1.GND1 v50,138.5
  Bottom 0.204: COL9.2 26.73,146.27 27,146 43.25,146 45.5,143.75 48.75,143.75 50,142.5 v50,138.5 v50,113.5 v50,88.5 v50,63.5 v50,38.5 v50,13.5
LED-GND3  (via drill 0.4)
  Top 0.204: P7.GND3 71.5,88.5 v72.5,89.5 | P7.GND4 71.5,63.5 v72.5,64.5 | P2.GND4 71.5,113.5 v72.5,114.5 | P2.GND3 71.5,138.5 v72.5,139.5 | P12.GND3 71.5,38.5 v72.5,39.5 | P12.GND4 71.5,13.5 v72.5,14.5
  Bottom 0.204: v72.5,14.5 72.5,20.5 70,23 70,28 72.5,30.5 v72.5,39.5 v72.5,64.5 72.5,70.5 70,73 70,77.75 72.5,80.25 v72.5,89.5 v72.5,114.5 72.5,120.5 70,123 70,127.75 72.5,130.25 v72.5,139.5 72.5,144 70.75,145.75 70.75,147.73 COL8.2
LED-GND4  (via drill 0.4)
  Top 0.204: v100,13.5 P12.GND2 | P12.GND1 v100,38.5 | P7.GND2 v100,63.5 | P7.GND1 v100,88.5 | P2.GND2 v100,113.5 | P2.GND1 v100,138.5
  Bottom 0.204: v100,13.5 v100,38.5 v100,63.5 v100,88.5 v100,113.5 v100,138.5 100,142 98.25,143.75 96,143.75 92.5,147.25 82.5,147.25 81.25,146 77,146 76.73,146.27 COL7.2
LED-GND5  (via drill 0.4)
  Top 0.204: P8.GND3 121.5,88.5 v122.5,89.5 | P13.GND3 121.5,38.5 v122.5,39.5 | P8.GND4 121.5,63.5 v122.5,64.5 | P3.GND4 121.5,113.5 v122.5,114.5 | P3.GND3 121.5,138.5 v122.5,139.5 | P13.GND4 121.5,13.5 v122.5,14.5
  Bottom 0.204: COL6.2 120.75,147.98 120.75,145.75 122.5,144 v122.5,139.5 122.5,130.25 120,127.75 120,123 122.5,120.5 v122.5,114.5 v122.5,89.5 122.5,80.25 120,77.75 120,73 122.5,70.5 v122.5,64.5 v122.5,39.5 122.5,30.75 120,28.25 120,23 122.5,20.5 v122.5,14.5
LED-GND6  (via drill 0.4)
  Top 0.204: v150,13.5 P13.GND2 | P13.GND1 v150,38.5 | P8.GND2 v150,63.5 | P8.GND1 v150,88.5 | P3.GND2 v150,113.5 | P3.GND1 v150,138.5
  Bottom 0.204: COL5.2 126.73,146.27 127,146 131,146 132,147 143.25,147 146.5,143.75 148.75,143.75 150,142.5 v150,138.5 v150,113.5 v150,88.5 v150,63.5 v150,38.5 v150,13.5
LED-GND7  (via drill 0.4)
  Top 0.204: P9.GND3 171.5,88.5 v172.5,89.5 | P4.GND4 171.5,113.5 v172.5,114.5 | P4.GND3 171.5,138.5 v172.5,139.5 | P9.GND4 171.5,63.5 v172.5,64.5 | P14.GND3 171.5,38.5 v172.5,39.5 | P14.GND4 171.5,13.5 v172.5,14.5
  Bottom 0.204: COL4.2 170.75,147.98 170.75,146 172.5,144.25 v172.5,139.5 172.5,130.25 170,127.75 170,123 172.5,120.5 v172.5,114.5 v172.5,89.5 172.5,80.25 170,77.75 170,73 172.5,70.5 v172.5,64.5 v172.5,39.5 172.5,30.25 170,27.75 170,23 172.5,20.5 v172.5,14.5
LED-GND8  (via drill 0.4)
  Top 0.204: P4.GND2 v200,113.5 | P4.GND1 v200,138.5 | P14.GND2 v200,13.5 | P9.GND1 v200,88.5 | P9.GND2 v200,63.5 | P14.GND1 v200,38.5
  Bottom 0.204: COL3.2 176.73,146.27 177,146 181.25,146 182.25,147 192.75,147 196,143.75 198,143.75 200,141.75 v200,138.5 v200,113.5 v200,88.5 v200,63.5 v200,38.5 v200,13.5
LED-GND9  (via drill 0.4)
  Top 0.204: P10.GND3 221.5,88.5 v222.5,89.5 | P10.GND4 221.5,63.5 v222.5,64.5 | P5.GND4 221.5,113.5 v222.5,114.5 | P5.GND3 221.5,138.5 v222.5,139.5 | P15.GND3 221.5,38.5 v222.5,39.5 | P15.GND4 221.5,13.5 v222.5,14.5
  Bottom 0.204: COL2.2 220.73,145.77 222.5,144 v222.5,139.5 222.5,130.25 220.25,128 220.25,123 222.5,120.75 v222.5,114.5 v222.5,89.5 222.5,80.5 220,78 220,73 222.5,70.5 v222.5,64.5 v222.5,39.5 222.5,30.75 220,28.25 220,23 222.5,20.5 v222.5,14.5
LED-GND10
  Top 0.204: COL1.2 226.73,146.27 227,146 232.25,146 233,146.75 242,146.75 247.25,141.5 247.25,138.5 | P15.GND1 247.25,38.5 | P15.GND2 247.25,13.5 247.25,38.5 | P10.GND2 247.25,63.5 | P5.GND2 247.25,113.5 | P5.GND1 247.25,138.5 | P10.GND1 247.25,88.5 | 247.25,38.5 247.25,41 242.75,45.5 242.75,54.25 247.25,58.75 247.25,63.5 | 247.25,63.5 247.25,88.5 | 247.25,88.5 247.25,91 242.75,95.5 242.75,104 247.25,108.5 247.25,113.5 | 247.25,113.5 247.25,138.5
N$1  (via drill 0.4 pad 0.5)  (1 unrouted)
  Top 0.204: P1.SIG6 24.8,142.2 v25.12,141.88
  Bottom 0.204: D1.P$2 27.5,131.75 27.5,139.5 v25.12,141.88
N$2  (via drill 0.4)
  Top 0.204: v47.5,142.25 36.57,142.25 P1.SIG2
  Bottom 0.204: v47.5,142.25 D2.P$2
N$3  (via drill 0.4)
  Top 0.204: P2.SIG6 v74.7,142.2
  Bottom 0.204: 74.8,142.2 74.75,142.25 v74.7,142.2 74.8,142.2 | 74.8,142.2 77.5,139.5 77.5,131.75 D3.P$2
N$4  (via drill 0.4)
  Top 0.204: v97.5,142.25 86.57,142.25 P2.SIG2
  Bottom 0.204: v97.5,142.25 D4.P$2
N$5  (via drill 0.4)
  Top 0.204: P3.SIG6 124.95,142.2 v125,142.25
  Bottom 0.204: v125,142.25 127.5,139.75 127.5,131.75 D5.P$2
N$6  (via drill 0.4)
  Top 0.204: v147.75,142.25 136.57,142.25 P3.SIG2
  Bottom 0.204: D6.P$2 v147.75,142.25
N$7  (via drill 0.4)
  Top 0.204: v147.75,117.25 136.6,117.25 P3.SIG4
  Bottom 0.204: D16.P$2 v147.75,117.25
N$8  (via drill 0.4)
  Top 0.204: P3.SIG8 125.67,117.17 v125.75,117.25
  Bottom 0.204: v125.75,117.25 125.75,122.25 124,124 D15.P$2
N$9  (via drill 0.4)
  Top 0.204: P2.SIG4 97.42,117.17 v97.5,117.25
  Bottom 0.204: v97.5,117.25 D14.P$2
N$10  (via drill 0.4)
  Top 0.204: P2.SIG8 75.92,117.17 v76,117.25
  Bottom 0.204: v76,117.25 76,122 74,124 D13.P$2
N$11  (via drill 0.4)
  Top 0.204: v47.5,117.25 36.6,117.25 P1.SIG4
  Bottom 0.204: D12.P$2 v47.5,117.25
N$12  (via drill 0.4)
  Top 0.204: P1.SIG8 25.67,117.17 v25.75,117.25
  Bottom 0.204: v25.75,117.25 25.75,122.25 24,124 D11.P$2
N$13  (via drill 0.4)
  Top 0.204: P4.SIG6 175.2,142.2 v175.25,142.25
  Bottom 0.204: v175.25,142.25 177.5,140 177.5,131.75 D7.P$2
N$14  (via drill 0.4)
  Top 0.204: P4.SIG2 197.45,142.2 v197.5,142.25
  Bottom 0.204: v197.5,142.25 D8.P$2
N$15  (via drill 0.4)
  Top 0.204: 211.57,142.25 P5.SIG6 225.2,142.2 v225.25,142.25
  Bottom 0.204: v225.25,142.25 227.5,140 227.5,131.75 D9.P$2
N$16  (via drill 0.4 pad 0.5)
  Top 0.204: P5.SIG2 237.8,142.2 v240,140 | v240,137 242.5,134.5 D10.P$2
  Bottom 0.204: v240,140 v240,137
N$17  (via drill 0.4)
  Top 0.204: P6.SIG6 27.45,92.2 v27.5,92.25
  Bottom 0.204: v27.5,92.25 27.5,81.75 D21.P$2
N$18  (via drill 0.4)
  Top 0.204: v47.5,92.25 36.57,92.25 P6.SIG2
  Bottom 0.204: v47.5,92.25 D22.P$2
N$19  (via drill 0.4)
  Top 0.204: P6.SIG4 47.42,67.17 v47.5,67.25
  Bottom 0.204: v47.5,67.25 D32.P$2
N$20  (via drill 0.4)
  Top 0.204: P6.SIG8 25.67,67.17 v25.75,67.25
  Bottom 0.204: v25.75,67.25 25.75,72.25 24,74 D31.P$2
N$21
  Top 0.204: P5.SIG4 236.52,118.02 D20.P$2
N$22  (via drill 0.4)
  Top 0.204: v225.75,117.25 211.6,117.25 P5.SIG8
  Bottom 0.204: D19.P$2 224,124 225.75,122.25 v225.75,117.25
N$23  (via drill 0.4)
  Top 0.204: P4.SIG4 197.42,117.17 v197.5,117.25
  Bottom 0.204: v197.5,117.25 D18.P$2
N$24  (via drill 0.4)
  Top 0.204: P4.SIG8 175.67,117.17 v175.75,117.25
  Bottom 0.204: D17.P$2 174,124 175.75,122.25 v175.75,117.25
N$25  (via drill 0.4)
  Top 0.204: P7.SIG6 77.45,92.2 v77.5,92.25
  Bottom 0.204: v77.5,92.25 77.5,81.75 D23.P$2
N$26  (via drill 0.4)
  Top 0.204: v97.5,92.25 86.57,92.25 P7.SIG2
  Bottom 0.204: v97.5,92.25 D24.P$2
N$27  (via drill 0.4)
  Top 0.204: P7.SIG8 75.92,67.17 v76,67.25
  Bottom 0.204: v76,67.25 76,72 74,74 D33.P$2
N$28  (via drill 0.4)
  Top 0.204: P7.SIG4 97.42,67.17 v97.5,67.25
  Bottom 0.204: v97.5,67.25 D34.P$2
N$29  (via drill 0.4 pad 0.5)
  Top 0.204: P10.SIG2 237.55,92.2 v240,89.75 | v240,86.5 242.5,84 D30.P$2
  Bottom 0.204: v240,89.75 v240,86.5
N$30  (via drill 0.4)
  Top 0.204: P10.SIG6 227.45,92.2 v227.5,92.25
  Bottom 0.204: v227.5,92.25 227.5,81.75 D29.P$2
N$31  (via drill 0.4)
  Top 0.204: P10.SIG8 225.67,67.17 v225.75,67.25
  Bottom 0.204: v225.75,67.25 225.75,72.25 224,74 D39.P$2
N$32
  Top 0.204: P10.SIG4 236.52,68.02 D40.P$2
N$33  (via drill 0.4)
  Top 0.204: v147.5,42.25 136.57,42.25 P13.SIG2
  Bottom 0.204: v147.5,42.25 D46.P$2
N$34  (via drill 0.4)
  Top 0.204: P13.SIG6 127.45,42.2 v127.5,42.25
  Bottom 0.204: v127.5,42.25 127.5,31.75 D45.P$2
N$35  (via drill 0.4)
  Top 0.204: P13.SIG8 125.42,17.17 v125.5,17.25
  Bottom 0.204: v125.5,17.25 125.5,22.5 124,24 D55.P$2
N$36  (via drill 0.4)
  Top 0.204: P13.SIG4 147.42,17.17 v147.5,17.25
  Bottom 0.204: v147.5,17.25 D56.P$2
N$37  (via drill 0.4)
  Top 0.204: P14.SIG6 177.45,42.2 v177.5,42.25
  Bottom 0.204: v177.5,42.25 177.5,31.75 D47.P$2
N$38  (via drill 0.4)
  Top 0.204: v197.5,42.25 186.57,42.25 P14.SIG2
  Bottom 0.204: D48.P$2 v197.5,42.25
N$39  (via drill 0.4)
  Top 0.204: P14.SIG4 197.42,17.17 v197.5,17.25
  Bottom 0.204: v197.5,17.25 D58.P$2
N$40  (via drill 0.4)
  Top 0.204: P14.SIG8 175.42,17.17 v175.5,17.25
  Bottom 0.204: v175.5,17.25 175.5,22.5 174,24 D57.P$2
N$41  (via drill 0.4)
  Top 0.204: P11.SIG8 25.67,17.17 v25.75,17.25
  Bottom 0.204: v25.75,17.25 25.75,22.25 24,24 D51.P$2
N$42  (via drill 0.4)
  Top 0.204: 11.57,42.25 P11.SIG6 27.45,42.2 v27.5,42.25
  Bottom 0.204: v27.5,42.25 27.5,31.75 D41.P$2
N$43  (via drill 0.4)
  Top 0.204: v47.5,42.25 36.57,42.25 P11.SIG2
  Bottom 0.204: v47.5,42.25 D42.P$2
N$44  (via drill 0.4)
  Top 0.204: v47.5,17.25 36.6,17.25 P11.SIG4
  Bottom 0.204: D52.P$2 v47.5,17.25
N$45  (via drill 0.4)
  Top 0.204: P8.SIG6 127.45,92.2 v127.5,92.25
  Bottom 0.204: v127.5,92.25 127.5,81.75 D25.P$2
N$46  (via drill 0.4)
  Top 0.204: P8.SIG8 125.92,67.17 v126,67.25
  Bottom 0.204: v126,67.25 126,72 124,74 D35.P$2
N$47  (via drill 0.4)
  Top 0.204: P8.SIG4 147.42,67.17 v147.5,67.25
  Bottom 0.204: v147.5,67.25 D36.P$2
N$48  (via drill 0.4)
  Top 0.204: v147.5,92.25 136.57,92.25 P8.SIG2
  Bottom 0.204: v147.5,92.25 D26.P$2
N$49  (via drill 0.4)
  Top 0.204: P9.SIG6 177.45,92.2 v177.5,92.25
  Bottom 0.204: v177.5,92.25 177.5,81.75 D27.P$2
N$50  (via drill 0.4)
  Top 0.204: P9.SIG2 198.2,92.2 v198.25,92.25
  Bottom 0.204: v198.25,92.25 198.25,78 197.5,77.25 D28.P$2
N$51  (via drill 0.4)
  Top 0.204: P9.SIG8 175.67,67.17 v175.75,67.25
  Bottom 0.204: v175.75,67.25 175.75,72.25 174,74 D37.P$2
N$52  (via drill 0.4)
  Top 0.204: P9.SIG4 197.42,67.17 v197.5,67.25
  Bottom 0.204: v197.5,67.25 D38.P$2
N$53  (via drill 0.4)
  Top 0.204: P12.SIG6 77.45,42.2 v77.5,42.25
  Bottom 0.204: v77.5,42.25 77.5,31.75 D43.P$2
N$54  (via drill 0.4)
  Top 0.204: v97.5,42.25 86.57,42.25 P12.SIG2
  Bottom 0.204: v97.5,42.25 D44.P$2
N$55  (via drill 0.4)
  Top 0.204: P12.SIG8 75.67,17.17 v75.75,17.25
  Bottom 0.204: v75.75,17.25 75.75,22.25 74,24 D53.P$2
N$56  (via drill 0.4)
  Top 0.204: P12.SIG4 97.42,17.17 v97.5,17.25
  Bottom 0.204: v97.5,17.25 D54.P$2
N$57  (via drill 0.4 pad 0.5)
  Top 0.204: P15.SIG2 237.55,42.2 v239.75,40 | v239.75,36.5 242.5,33.75 D50.P$2
  Bottom 0.204: v239.75,40 v239.75,36.5
N$58  (via drill 0.4)
  Top 0.204: P15.SIG6 227.45,42.2 v227.5,42.25
  Bottom 0.204: v227.5,42.25 227.5,31.75 D49.P$2
N$59  (via drill 0.4)
  Top 0.204: P15.SIG8 225.75,17.17 v225.75,17.25
  Bottom 0.204: D59.P$2 224,24 225.75,22.25 v225.75,17.25
N$60
  Top 0.204: P15.SIG4 236.52,18.02 D60.P$2
RED1
  Top 0.204: P5.RED1 P5.RED3 P4.RED1 P4.RED3 P3.RED1 P3.RED3 P2.RED1 P2.RED3 P1.RED1 P1.RED3 3.98,131.98 ROW1.2
RED2
  Top 0.204: P5.RED2 P5.RED4 P4.RED2 P4.RED4 P3.RED2 P3.RED4 P2.RED2 P2.RED4 P1.RED2 P1.RED4 10,115.5 6.5,119 6.5,123.48 ROW2.2
RED3
  Top 0.204: P10.RED1 P10.RED3 P9.RED1 P9.RED3 P8.RED1 P8.RED3 P7.RED1 P7.RED3 P6.RED1 P6.RED3 3.98,81.98 ROW3.2
RED4
  Top 0.204: P10.RED2 P10.RED4 P9.RED2 P9.RED4 P8.RED2 P8.RED4 P7.RED2 P7.RED4 P6.RED2 P6.RED4 10.5,65.5 6.52,69.48 ROW4.2
RED5
  Top 0.204: P15.RED1 P15.RED3 P14.RED1 P14.RED3 P13.RED1 P13.RED3 P12.RED1 P12.RED3 P11.RED1 P11.RED3 3.98,31.98 ROW5.2
RED6
  Top 0.204: P15.RED2 P15.RED4 P14.RED2 P14.RED4 P13.RED2 P13.RED4 P12.RED2 P12.RED4 P11.RED2 P11.RED4 10.25,15.5 6.5,19.25 6.5,22.98 ROW6.2
SWITCH1
  Top 0.204: P5.SIG1 P5.SIG5 P4.SIG1 P4.SIG5 P3.SIG1 P3.SIG5 P2.SIG1 P2.SIG5 P1.SIG1 P1.SIG5 1.44,136.6 ROW1.1
SWITCH2
  Top 0.204: P5.SIG3 P5.SIG7 P4.SIG3 P4.SIG7 P3.SIG3 P3.SIG7 P2.SIG3 P2.SIG7 P1.SIG3 P1.SIG7 9.06,120.14 ROW2.1
SWITCH3
  Top 0.204: P10.SIG1 P10.SIG5 P9.SIG1 P9.SIG5 P8.SIG1 P8.SIG5 P7.SIG1 P7.SIG5 P6.SIG1 P6.SIG5 1.44,86.6 ROW3.1
SWITCH4
  Top 0.204: P10.SIG3 P10.SIG7 P9.SIG3 P9.SIG7 P8.SIG3 P8.SIG7 P7.SIG3 P7.SIG7 P6.SIG3 P6.SIG7 9.06,70.14 ROW4.1
SWITCH5
  Top 0.204: P15.SIG1 P15.SIG5 P14.SIG1 P14.SIG5 P13.SIG1 P13.SIG5 P12.SIG1 P12.SIG5 P11.SIG1 P11.SIG5 1.44,36.6 ROW5.1
SWITCH6
  Top 0.204: P15.SIG3 P15.SIG7 P14.SIG3 P14.SIG7 P13.SIG3 P13.SIG7 P12.SIG3 P12.SIG7 P11.SIG3 P11.SIG7 9.06,20.14 ROW6.1
SWT-GND1
  Bottom 0.204: D51.P$1 D41.P$1 D31.P$1 D21.P$1 D11.P$1 D1.P$1 28.5,140.5 23.27,145.73 COL10.1
SWT-GND2
  Bottom 0.204: D52.P$1 D42.P$1 53.5,44.75 55,46.25 55,55 53.5,56.5 D32.P$1 D22.P$1 53.5,94.75 55.5,96.75 55.5,103.5 53.5,105.5 D12.P$1 D2.P$1 53.5,140.75 49.5,144.75 45.75,144.75 42.75,147.75 COL9.1
SWT-GND3
  Bottom 0.204: D53.P$1 D43.P$1 D33.P$1 D23.P$1 D13.P$1 D3.P$1 78.5,140.5 73.27,145.73 COL8.1
SWT-GND4
  Bottom 0.204: D54.P$1 D44.P$1 103.5,44 105,45.5 105,54.5 103.5,56 D34.P$1 D24.P$1 103.5,94 105,95.5 105,104.5 103.5,106 D14.P$1 D4.P$1 103.5,140.5 99.25,144.75 96.25,144.75 93.25,147.75 COL7.1
SWT-GND5
  Bottom 0.204: D55.P$1 D45.P$1 D35.P$1 D25.P$1 D15.P$1 D5.P$1 128.5,140.5 123.27,145.73 COL6.1
SWT-GND6
  Bottom 0.204: D56.P$1 D46.P$1 153.5,44 155.5,46 155.5,54 153.5,56 D36.P$1 D26.P$1 153.5,94 155,95.5 155,104.5 153.75,105.75 D16.P$1 D6.P$1 153.75,140.5 149.5,144.75 146.75,144.75 143.75,147.75 COL5.1
SWT-GND7
  Bottom 0.204: D57.P$1 D47.P$1 D37.P$1 D27.P$1 D17.P$1 D7.P$1 178.5,140.5 173.27,145.73 COL4.1
SWT-GND8
  Bottom 0.204: D58.P$1 D48.P$1 203.5,44 205,45.5 205,54.5 203.5,56 D38.P$1 D28.P$1 203.5,94 205,95.5 205,104.5 203.5,106 D18.P$1 D8.P$1 203.5,140.5 199.25,144.75 196.5,144.75 193.5,147.75 COL3.1
SWT-GND9
  Bottom 0.204: D59.P$1 D49.P$1 D39.P$1 D29.P$1 D19.P$1 D9.P$1 228.5,140.5 223.27,145.73 COL2.1
SWT-GND10
  Top 0.204: D60.P$1 D50.P$1 248.5,41.75 244.25,46 244.25,53.75 248.5,58 D40.P$1 D30.P$1 248.5,91.75 244.75,95.5 244.75,104 248.5,107.75 D20.P$1 D10.P$1 248.5,142.5 243.25,147.75 COL1.1

### Text on the board
tPlace: LambdaControl ButtonPad v1